# EAGLE schematic scheme (EAGLE 8.6.0)
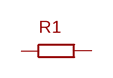
[diagram p0: schematic, sheet 1]

## Parts
R1  R  (no package)
Unconnected: R1.1 R1.2

## Library data of the parts
R1 = ngspice-simulation:R: RESISTOR